# Altium schematic sheet MiniSTM32.SchDoc
size A4
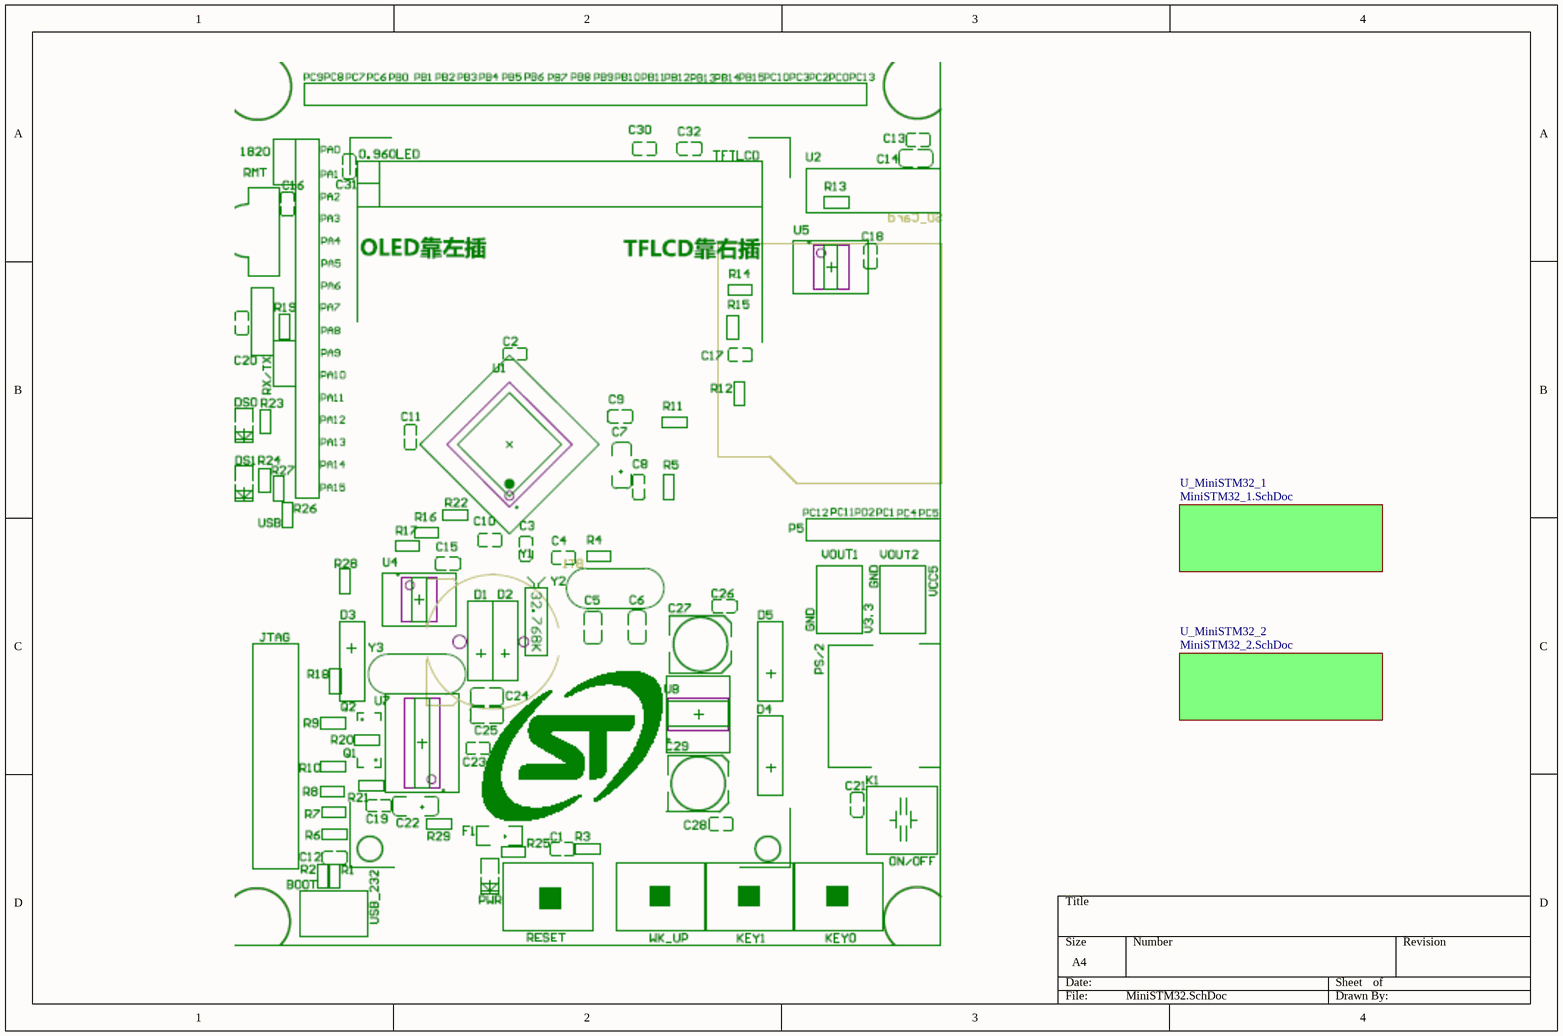
[diagram p0: MiniSTM32.SchDoc]

## Sub-sheets
U_MiniSTM32_1 = MiniSTM32_1.SchDoc: no entries
U_MiniSTM32_2 = MiniSTM32_2.SchDoc: no entries